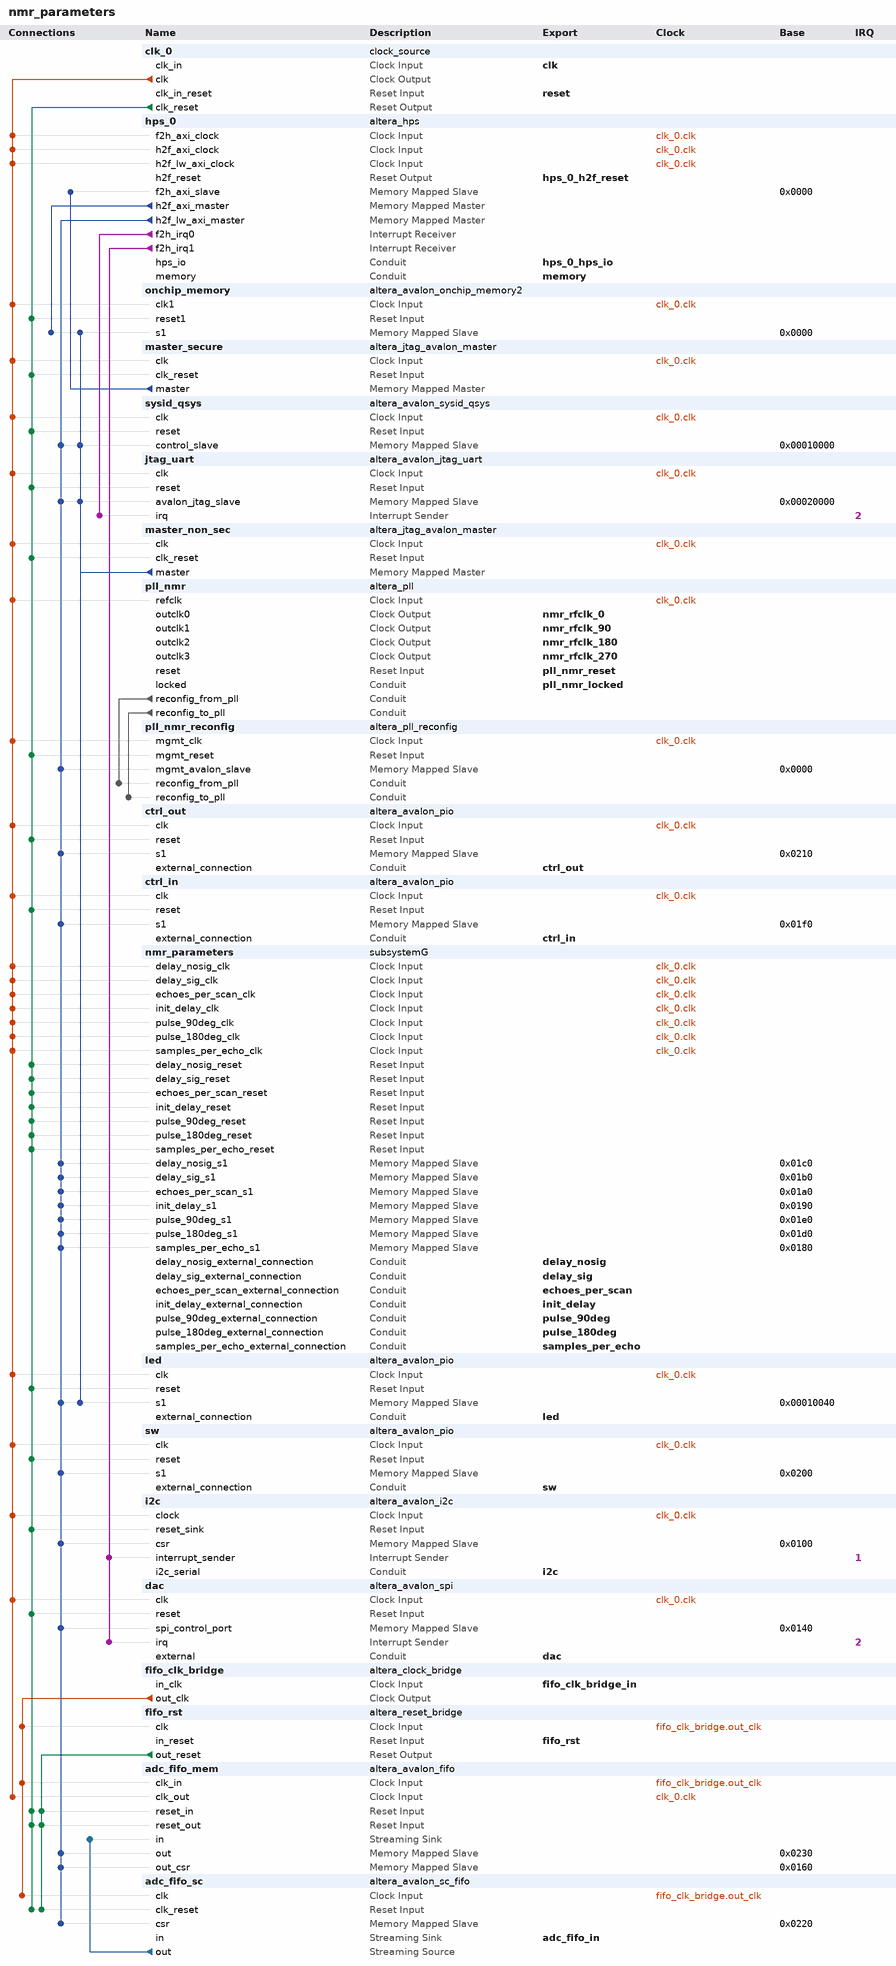
[diagram p0: system contents]
# Platform Designer (Qsys) system nmr_parameters, Cyclone V 5CSEMA5F31C6
# Parameters at their usual value, and those the tool derives, are not listed.
package require -exact qsys 16.1
create_system nmr_parameters
set_project_property DEVICE_FAMILY {Cyclone V}
set_project_property DEVICE 5CSEMA5F31C6

add_instance clk_0 clock_source 16.1
set_instance_parameter_value clk_0 clockFrequency 50000000

add_instance hps_0 altera_hps 16.1
set_instance_parameter_value hps_0 EMAC1_Mode RGMII
set_instance_parameter_value hps_0 EMAC1_PinMuxing {HPS I/O Set 0}
set_instance_parameter_value hps_0 F2SCLK_COLDRST_Enable false
set_instance_parameter_value hps_0 F2SCLK_DBGRST_Enable false
set_instance_parameter_value hps_0 F2SCLK_WARMRST_Enable false
set_instance_parameter_value hps_0 F2SINTERRUPT_Enable true
set_instance_parameter_value hps_0 F2S_Width 2
set_instance_parameter_value hps_0 FPGA_PERIPHERAL_OUTPUT_CLOCK_FREQ_EMAC0_GTX_CLK 100
set_instance_parameter_value hps_0 FPGA_PERIPHERAL_OUTPUT_CLOCK_FREQ_EMAC0_MD_CLK 100.0
set_instance_parameter_value hps_0 FPGA_PERIPHERAL_OUTPUT_CLOCK_FREQ_EMAC1_GTX_CLK 100
set_instance_parameter_value hps_0 FPGA_PERIPHERAL_OUTPUT_CLOCK_FREQ_EMAC1_MD_CLK 100.0
set_instance_parameter_value hps_0 HPS_PROTOCOL DDR3
set_instance_parameter_value hps_0 I2C0_Mode I2C
set_instance_parameter_value hps_0 I2C0_PinMuxing {HPS I/O Set 0}
set_instance_parameter_value hps_0 I2C1_Mode I2C
set_instance_parameter_value hps_0 I2C1_PinMuxing {HPS I/O Set 0}
set_instance_parameter_value hps_0 LWH2F_Enable true
set_instance_parameter_value hps_0 MEM_BANKADDR_WIDTH 3
set_instance_parameter_value hps_0 MEM_CLK_FREQ 400.0
set_instance_parameter_value hps_0 MEM_COL_ADDR_WIDTH 10
set_instance_parameter_value hps_0 MEM_DQ_WIDTH 32
set_instance_parameter_value hps_0 MEM_DRV_STR RZQ/7
set_instance_parameter_value hps_0 MEM_ROW_ADDR_WIDTH 15
set_instance_parameter_value hps_0 MEM_RTT_NOM RZQ/4
set_instance_parameter_value hps_0 MEM_RTT_WR RZQ/4
set_instance_parameter_value hps_0 MEM_TCL 11
set_instance_parameter_value hps_0 MEM_TFAW_NS 30.0
set_instance_parameter_value hps_0 MEM_TRAS_NS 35.0
set_instance_parameter_value hps_0 MEM_TRCD_NS 13.75
set_instance_parameter_value hps_0 MEM_TRFC_NS 260.0
set_instance_parameter_value hps_0 MEM_TRP_NS 13.75
set_instance_parameter_value hps_0 MEM_VENDOR JEDEC
set_instance_parameter_value hps_0 MEM_WTCL 8
set_instance_parameter_value hps_0 QSPI_Mode {1 SS}
set_instance_parameter_value hps_0 QSPI_PinMuxing {HPS I/O Set 0}
set_instance_parameter_value hps_0 REF_CLK_FREQ 25.0
set_instance_parameter_value hps_0 S2FCLK_USER2CLK 5
set_instance_parameter_value hps_0 S2F_Width 3
set_instance_parameter_value hps_0 SDIO_Mode {4-bit Data}
set_instance_parameter_value hps_0 SDIO_PinMuxing {HPS I/O Set 0}
set_instance_parameter_value hps_0 SPIM1_Mode {Single Slave Select}
set_instance_parameter_value hps_0 SPIM1_PinMuxing {HPS I/O Set 0}
set_instance_parameter_value hps_0 STM_Enable false
set_instance_parameter_value hps_0 TIMING_BOARD_AC_SKEW 0.03
set_instance_parameter_value hps_0 TIMING_BOARD_AC_TO_CK_SKEW 0.0
set_instance_parameter_value hps_0 TIMING_BOARD_DQ_TO_DQS_SKEW 0.0
set_instance_parameter_value hps_0 TIMING_BOARD_MAX_CK_DELAY 0.03
set_instance_parameter_value hps_0 TIMING_BOARD_MAX_DQS_DELAY 0.02
set_instance_parameter_value hps_0 TIMING_BOARD_SKEW_BETWEEN_DQS 0.08
set_instance_parameter_value hps_0 TIMING_BOARD_SKEW_CKDQS_DIMM_MAX 0.16
set_instance_parameter_value hps_0 TIMING_BOARD_SKEW_CKDQS_DIMM_MIN 0.09
set_instance_parameter_value hps_0 TIMING_BOARD_SKEW_WITHIN_DQS 0.01
set_instance_parameter_value hps_0 TIMING_TDH 65
set_instance_parameter_value hps_0 TIMING_TDQSCK 255
set_instance_parameter_value hps_0 TIMING_TDQSQ 125
set_instance_parameter_value hps_0 TIMING_TDS 30
set_instance_parameter_value hps_0 TIMING_TIH 140
set_instance_parameter_value hps_0 TIMING_TIS 180
set_instance_parameter_value hps_0 TIMING_TQSH 0.4
set_instance_parameter_value hps_0 UART0_Mode {No Flow Control}
set_instance_parameter_value hps_0 UART0_PinMuxing {HPS I/O Set 0}
set_instance_parameter_value hps_0 USB1_Mode SDR
set_instance_parameter_value hps_0 USB1_PinMuxing {HPS I/O Set 0}
set_instance_parameter_value hps_0 desired_cfg_clk_mhz 97.368421
set_instance_parameter_value hps_0 desired_qspi_clk_mhz 370.0

add_instance onchip_memory altera_avalon_onchip_memory2 16.1
set_instance_parameter_value onchip_memory dataWidth 64
set_instance_parameter_value onchip_memory dualPort false
set_instance_parameter_value onchip_memory initMemContent true
set_instance_parameter_value onchip_memory initializationFileName onchip_memory2_0
set_instance_parameter_value onchip_memory memorySize 65536

add_instance master_secure altera_jtag_avalon_master 16.1

add_instance sysid_qsys altera_avalon_sysid_qsys 16.1
set_instance_parameter_value sysid_qsys id -1395322110

add_instance jtag_uart altera_avalon_jtag_uart 16.1
set_instance_parameter_value jtag_uart allowMultipleConnections true
set_instance_parameter_value jtag_uart simInteractiveOptions INTERACTIVE_ASCII_OUTPUT

add_instance master_non_sec altera_jtag_avalon_master 16.1

add_instance pll_nmr altera_pll 16.1
set_instance_parameter_value pll_nmr gui_device_speed_grade 1
set_instance_parameter_value pll_nmr gui_en_reconf true
set_instance_parameter_value pll_nmr gui_number_of_clocks 4
set_instance_parameter_value pll_nmr gui_operation_mode direct
set_instance_parameter_value pll_nmr gui_output_clock_frequency0 4.3
set_instance_parameter_value pll_nmr gui_output_clock_frequency1 4.3
set_instance_parameter_value pll_nmr gui_output_clock_frequency2 4.3
set_instance_parameter_value pll_nmr gui_output_clock_frequency3 4.3
set_instance_parameter_value pll_nmr gui_pll_mode {Fractional-N PLL}
set_instance_parameter_value pll_nmr gui_reference_clock_frequency 50.0
set_instance_parameter_value pll_nmr gui_use_locked true

add_instance pll_nmr_reconfig altera_pll_reconfig 16.1

add_instance ctrl_out altera_avalon_pio 16.1
set_instance_parameter_value ctrl_out direction Output
set_instance_parameter_value ctrl_out resetValue 119
set_instance_parameter_value ctrl_out width 32

add_instance ctrl_in altera_avalon_pio 16.1
set_instance_parameter_value ctrl_in direction Input
set_instance_parameter_value ctrl_in width 8

add_instance nmr_parameters subsystemG 1.0

add_instance led altera_avalon_pio 16.1
set_instance_parameter_value led direction Output
set_instance_parameter_value led resetValue 1023
set_instance_parameter_value led width 10

add_instance sw altera_avalon_pio 16.1
set_instance_parameter_value sw direction Input
set_instance_parameter_value sw width 10

add_instance i2c altera_avalon_i2c 16.1
set_instance_parameter_value i2c FIFO_DEPTH 256

add_instance dac altera_avalon_spi 16.1
set_instance_parameter_value dac clockPolarity 1
set_instance_parameter_value dac dataWidth 24
set_instance_parameter_value dac masterSPI true
set_instance_parameter_value dac numberOfSlaves 1
set_instance_parameter_value dac targetClockRate 128000

add_instance fifo_clk_bridge altera_clock_bridge 16.1
set_instance_parameter_value fifo_clk_bridge DERIVED_CLOCK_RATE 0
set_instance_parameter_value fifo_clk_bridge EXPLICIT_CLOCK_RATE 0

add_instance fifo_rst altera_reset_bridge 16.1
set_instance_parameter_value fifo_rst ACTIVE_LOW_RESET 0
set_instance_parameter_value fifo_rst SYNCHRONOUS_EDGES deassert

add_instance adc_fifo_mem altera_avalon_fifo 16.1
set_instance_parameter_value adc_fifo_mem bitsPerSymbol 16
set_instance_parameter_value adc_fifo_mem channelWidth 0
set_instance_parameter_value adc_fifo_mem errorWidth 0
set_instance_parameter_value adc_fifo_mem fifoDepth 8192
set_instance_parameter_value adc_fifo_mem fifoInputInterfaceOptions AVALONST_SINK
set_instance_parameter_value adc_fifo_mem fifoOutputInterfaceOptions AVALONMM_READ
set_instance_parameter_value adc_fifo_mem singleClockMode false
set_instance_parameter_value adc_fifo_mem symbolsPerBeat 2
set_instance_parameter_value adc_fifo_mem useIRQ false
set_instance_parameter_value adc_fifo_mem usePacket false
set_instance_parameter_value adc_fifo_mem useReadControl true
set_instance_parameter_value adc_fifo_mem useWriteControl false

add_instance adc_fifo_sc altera_avalon_sc_fifo 16.1
set_instance_parameter_value adc_fifo_sc BITS_PER_SYMBOL 16
set_instance_parameter_value adc_fifo_sc CHANNEL_WIDTH 0
set_instance_parameter_value adc_fifo_sc ERROR_WIDTH 0
set_instance_parameter_value adc_fifo_sc FIFO_DEPTH 131072
set_instance_parameter_value adc_fifo_sc USE_FILL_LEVEL 1
set_instance_parameter_value adc_fifo_sc USE_MEMORY_BLOCKS 1
set_instance_parameter_value adc_fifo_sc USE_STORE_FORWARD 0

# connections
add_connection clk_0.clk adc_fifo_mem.clk_out clock
add_connection clk_0.clk ctrl_in.clk clock
add_connection clk_0.clk ctrl_out.clk clock
add_connection clk_0.clk dac.clk clock
add_connection clk_0.clk hps_0.f2h_axi_clock clock
add_connection clk_0.clk hps_0.h2f_axi_clock clock
add_connection clk_0.clk hps_0.h2f_lw_axi_clock clock
add_connection clk_0.clk i2c.clock clock
add_connection clk_0.clk jtag_uart.clk clock
add_connection clk_0.clk led.clk clock
add_connection clk_0.clk master_non_sec.clk clock
add_connection clk_0.clk master_secure.clk clock
add_connection clk_0.clk nmr_parameters.delay_nosig_clk clock
add_connection clk_0.clk nmr_parameters.delay_sig_clk clock
add_connection clk_0.clk nmr_parameters.echoes_per_scan_clk clock
add_connection clk_0.clk nmr_parameters.init_delay_clk clock
add_connection clk_0.clk nmr_parameters.pulse_90deg_clk clock
add_connection clk_0.clk nmr_parameters.pulse_180deg_clk clock
add_connection clk_0.clk nmr_parameters.samples_per_echo_clk clock
add_connection clk_0.clk onchip_memory.clk1 clock
add_connection clk_0.clk pll_nmr.refclk clock
add_connection clk_0.clk pll_nmr_reconfig.mgmt_clk clock
add_connection clk_0.clk sw.clk clock
add_connection clk_0.clk sysid_qsys.clk clock
add_connection fifo_clk_bridge.out_clk adc_fifo_mem.clk_in clock
add_connection fifo_clk_bridge.out_clk adc_fifo_sc.clk clock
add_connection fifo_clk_bridge.out_clk fifo_rst.clk clock
add_connection clk_0.clk_reset adc_fifo_mem.reset_in reset
add_connection clk_0.clk_reset adc_fifo_mem.reset_out reset
add_connection clk_0.clk_reset adc_fifo_sc.clk_reset reset
add_connection clk_0.clk_reset ctrl_in.reset reset
add_connection clk_0.clk_reset ctrl_out.reset reset
add_connection clk_0.clk_reset dac.reset reset
add_connection clk_0.clk_reset i2c.reset_sink reset
add_connection clk_0.clk_reset jtag_uart.reset reset
add_connection clk_0.clk_reset led.reset reset
add_connection clk_0.clk_reset master_non_sec.clk_reset reset
add_connection clk_0.clk_reset master_secure.clk_reset reset
add_connection clk_0.clk_reset nmr_parameters.delay_nosig_reset reset
add_connection clk_0.clk_reset nmr_parameters.delay_sig_reset reset
add_connection clk_0.clk_reset nmr_parameters.echoes_per_scan_reset reset
add_connection clk_0.clk_reset nmr_parameters.init_delay_reset reset
add_connection clk_0.clk_reset nmr_parameters.pulse_90deg_reset reset
add_connection clk_0.clk_reset nmr_parameters.pulse_180deg_reset reset
add_connection clk_0.clk_reset nmr_parameters.samples_per_echo_reset reset
add_connection clk_0.clk_reset onchip_memory.reset1 reset
add_connection clk_0.clk_reset pll_nmr_reconfig.mgmt_reset reset
add_connection clk_0.clk_reset sw.reset reset
add_connection clk_0.clk_reset sysid_qsys.reset reset
add_connection fifo_rst.out_reset adc_fifo_mem.reset_in reset
add_connection fifo_rst.out_reset adc_fifo_mem.reset_out reset
add_connection fifo_rst.out_reset adc_fifo_sc.clk_reset reset
add_connection hps_0.h2f_axi_master onchip_memory.s1 avalon
set_connection_parameter_value hps_0.h2f_axi_master/onchip_memory.s1 baseAddress 0x0000
add_connection hps_0.h2f_lw_axi_master adc_fifo_mem.out avalon
set_connection_parameter_value hps_0.h2f_lw_axi_master/adc_fifo_mem.out baseAddress 0x0230
add_connection hps_0.h2f_lw_axi_master adc_fifo_mem.out_csr avalon
set_connection_parameter_value hps_0.h2f_lw_axi_master/adc_fifo_mem.out_csr baseAddress 0x0160
add_connection hps_0.h2f_lw_axi_master adc_fifo_sc.csr avalon
set_connection_parameter_value hps_0.h2f_lw_axi_master/adc_fifo_sc.csr baseAddress 0x0220
add_connection hps_0.h2f_lw_axi_master ctrl_in.s1 avalon
set_connection_parameter_value hps_0.h2f_lw_axi_master/ctrl_in.s1 baseAddress 0x01f0
add_connection hps_0.h2f_lw_axi_master ctrl_out.s1 avalon
set_connection_parameter_value hps_0.h2f_lw_axi_master/ctrl_out.s1 baseAddress 0x0210
add_connection hps_0.h2f_lw_axi_master dac.spi_control_port avalon
set_connection_parameter_value hps_0.h2f_lw_axi_master/dac.spi_control_port baseAddress 0x0140
add_connection hps_0.h2f_lw_axi_master i2c.csr avalon
set_connection_parameter_value hps_0.h2f_lw_axi_master/i2c.csr baseAddress 0x0100
add_connection hps_0.h2f_lw_axi_master jtag_uart.avalon_jtag_slave avalon
set_connection_parameter_value hps_0.h2f_lw_axi_master/jtag_uart.avalon_jtag_slave baseAddress 0x00020000
add_connection hps_0.h2f_lw_axi_master led.s1 avalon
set_connection_parameter_value hps_0.h2f_lw_axi_master/led.s1 baseAddress 0x00010040
add_connection hps_0.h2f_lw_axi_master nmr_parameters.delay_nosig_s1 avalon
set_connection_parameter_value hps_0.h2f_lw_axi_master/nmr_parameters.delay_nosig_s1 baseAddress 0x01c0
add_connection hps_0.h2f_lw_axi_master nmr_parameters.delay_sig_s1 avalon
set_connection_parameter_value hps_0.h2f_lw_axi_master/nmr_parameters.delay_sig_s1 baseAddress 0x01b0
add_connection hps_0.h2f_lw_axi_master nmr_parameters.echoes_per_scan_s1 avalon
set_connection_parameter_value hps_0.h2f_lw_axi_master/nmr_parameters.echoes_per_scan_s1 baseAddress 0x01a0
add_connection hps_0.h2f_lw_axi_master nmr_parameters.init_delay_s1 avalon
set_connection_parameter_value hps_0.h2f_lw_axi_master/nmr_parameters.init_delay_s1 baseAddress 0x0190
add_connection hps_0.h2f_lw_axi_master nmr_parameters.pulse_90deg_s1 avalon
set_connection_parameter_value hps_0.h2f_lw_axi_master/nmr_parameters.pulse_90deg_s1 baseAddress 0x01e0
add_connection hps_0.h2f_lw_axi_master nmr_parameters.pulse_180deg_s1 avalon
set_connection_parameter_value hps_0.h2f_lw_axi_master/nmr_parameters.pulse_180deg_s1 baseAddress 0x01d0
add_connection hps_0.h2f_lw_axi_master nmr_parameters.samples_per_echo_s1 avalon
set_connection_parameter_value hps_0.h2f_lw_axi_master/nmr_parameters.samples_per_echo_s1 baseAddress 0x0180
add_connection hps_0.h2f_lw_axi_master pll_nmr_reconfig.mgmt_avalon_slave avalon
set_connection_parameter_value hps_0.h2f_lw_axi_master/pll_nmr_reconfig.mgmt_avalon_slave baseAddress 0x0000
add_connection hps_0.h2f_lw_axi_master sw.s1 avalon
set_connection_parameter_value hps_0.h2f_lw_axi_master/sw.s1 baseAddress 0x0200
add_connection hps_0.h2f_lw_axi_master sysid_qsys.control_slave avalon
set_connection_parameter_value hps_0.h2f_lw_axi_master/sysid_qsys.control_slave baseAddress 0x00010000
add_connection master_non_sec.master jtag_uart.avalon_jtag_slave avalon
set_connection_parameter_value master_non_sec.master/jtag_uart.avalon_jtag_slave baseAddress 0x00020000
add_connection master_non_sec.master led.s1 avalon
set_connection_parameter_value master_non_sec.master/led.s1 baseAddress 0x00010040
add_connection master_non_sec.master onchip_memory.s1 avalon
set_connection_parameter_value master_non_sec.master/onchip_memory.s1 baseAddress 0x0000
add_connection master_non_sec.master sysid_qsys.control_slave avalon
set_connection_parameter_value master_non_sec.master/sysid_qsys.control_slave baseAddress 0x00010000
add_connection master_secure.master hps_0.f2h_axi_slave avalon
set_connection_parameter_value master_secure.master/hps_0.f2h_axi_slave baseAddress 0x0000
add_connection adc_fifo_sc.out adc_fifo_mem.in avalon_streaming
add_connection pll_nmr.reconfig_from_pll pll_nmr_reconfig.reconfig_from_pll conduit
add_connection pll_nmr.reconfig_to_pll pll_nmr_reconfig.reconfig_to_pll conduit
add_connection hps_0.f2h_irq0 jtag_uart.irq interrupt
set_connection_parameter_value hps_0.f2h_irq0/jtag_uart.irq irqNumber 2
add_connection hps_0.f2h_irq1 dac.irq interrupt
set_connection_parameter_value hps_0.f2h_irq1/dac.irq irqNumber 2
add_connection hps_0.f2h_irq1 i2c.interrupt_sender interrupt
set_connection_parameter_value hps_0.f2h_irq1/i2c.interrupt_sender irqNumber 1

# exported interfaces
add_interface adc_fifo_in avalon_streaming sink
set_interface_property adc_fifo_in EXPORT_OF adc_fifo_sc.in
add_interface clk clock sink
set_interface_property clk EXPORT_OF clk_0.clk_in
add_interface ctrl_in conduit end
set_interface_property ctrl_in EXPORT_OF ctrl_in.external_connection
add_interface ctrl_out conduit end
set_interface_property ctrl_out EXPORT_OF ctrl_out.external_connection
add_interface dac conduit end
set_interface_property dac EXPORT_OF dac.external
add_interface delay_nosig conduit end
set_interface_property delay_nosig EXPORT_OF nmr_parameters.delay_nosig_external_connection
add_interface delay_sig conduit end
set_interface_property delay_sig EXPORT_OF nmr_parameters.delay_sig_external_connection
add_interface echoes_per_scan conduit end
set_interface_property echoes_per_scan EXPORT_OF nmr_parameters.echoes_per_scan_external_connection
add_interface fifo_clk_bridge_in clock sink
set_interface_property fifo_clk_bridge_in EXPORT_OF fifo_clk_bridge.in_clk
add_interface fifo_rst reset sink
set_interface_property fifo_rst EXPORT_OF fifo_rst.in_reset
add_interface hps_0_h2f_reset reset source
set_interface_property hps_0_h2f_reset EXPORT_OF hps_0.h2f_reset
add_interface hps_0_hps_io conduit end
set_interface_property hps_0_hps_io EXPORT_OF hps_0.hps_io
add_interface i2c conduit end
set_interface_property i2c EXPORT_OF i2c.i2c_serial
add_interface init_delay conduit end
set_interface_property init_delay EXPORT_OF nmr_parameters.init_delay_external_connection
add_interface led conduit end
set_interface_property led EXPORT_OF led.external_connection
add_interface memory conduit end
set_interface_property memory EXPORT_OF hps_0.memory
add_interface nmr_rfclk_0 clock source
set_interface_property nmr_rfclk_0 EXPORT_OF pll_nmr.outclk0
add_interface nmr_rfclk_180 clock source
set_interface_property nmr_rfclk_180 EXPORT_OF pll_nmr.outclk2
add_interface nmr_rfclk_270 clock source
set_interface_property nmr_rfclk_270 EXPORT_OF pll_nmr.outclk3
add_interface nmr_rfclk_90 clock source
set_interface_property nmr_rfclk_90 EXPORT_OF pll_nmr.outclk1
add_interface pll_nmr_locked conduit end
set_interface_property pll_nmr_locked EXPORT_OF pll_nmr.locked
add_interface pll_nmr_reset reset sink
set_interface_property pll_nmr_reset EXPORT_OF pll_nmr.reset
add_interface pulse_180deg conduit end
set_interface_property pulse_180deg EXPORT_OF nmr_parameters.pulse_180deg_external_connection
add_interface pulse_90deg conduit end
set_interface_property pulse_90deg EXPORT_OF nmr_parameters.pulse_90deg_external_connection
add_interface reset reset sink
set_interface_property reset EXPORT_OF clk_0.clk_in_reset
add_interface samples_per_echo conduit end
set_interface_property samples_per_echo EXPORT_OF nmr_parameters.samples_per_echo_external_connection
add_interface sw conduit end
set_interface_property sw EXPORT_OF sw.external_connection

set_interconnect_requirement {$system} qsys_mm.clockCrossingAdapter HANDSHAKE
set_interconnect_requirement {$system} qsys_mm.maxAdditionalLatency 1

save_system nmr_parameters.qsys
